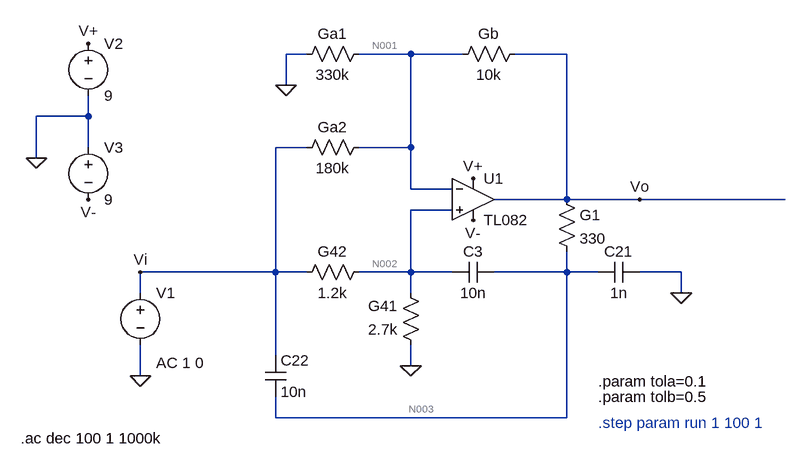
[diagram p0: schematic Sedra Etapa2.asc]
* Sedra Etapa2.asc
R§G42 N002 Vi 1.2k
R§G41 0 N002 2.7k
R§Ga2 Vi N001 180k
R§Ga1 0 N001 330k
R§Gb N001 Vo 10k
R§G1 Vo N003 330
* U1: TL082 (symbol PAULOlib\TL082 not available, pins judged from their places): In+=N002 In-=N001 V+=V+ V-=V- OUT=Vo
C3 N003 N002 10n
C22 Vi N003 10n
C21 0 N003 1n
V1 Vi 0 AC 1 0
V2 V+ 0 9
V3 0 V- 9
.param tola=0.1
.param tolb=0.5
* .step param run 1 100 1
.ac dec 100 1 1000k
.backanno
.end

* Results of the author's LTspice run, read from the files saved beside the schematic
* Operating Point, zero values left out:
*   V(n002) = -32.44 nV
*   V(n001) = 10.94 µV
*   V(vo) = 12.27 µV
*   V(n003) = 12.27 µV
*   V(v-) = -9 V
*   V(v+) = 9 V
*   I(Gb) = -133 pA
*   I(Ga1) = -33.15 pA
*   I(Ga2) = -60.77 pA
*   I(G41) = 12.02 pA
*   I(G42) = -27.04 pA
*   I(V3) = -8.595 mA
*   I(V2) = -8.594 mA
*   I(V1) = 33.73 pA
*   Ix(u1:1) = 39.05 pA
*   Ix(u1:2) = 39.05 pA
*   Ix(u1:3) = 8.594 mA
*   Ix(u1:4) = -8.595 mA
*   Ix(u1:5) = -133 pA
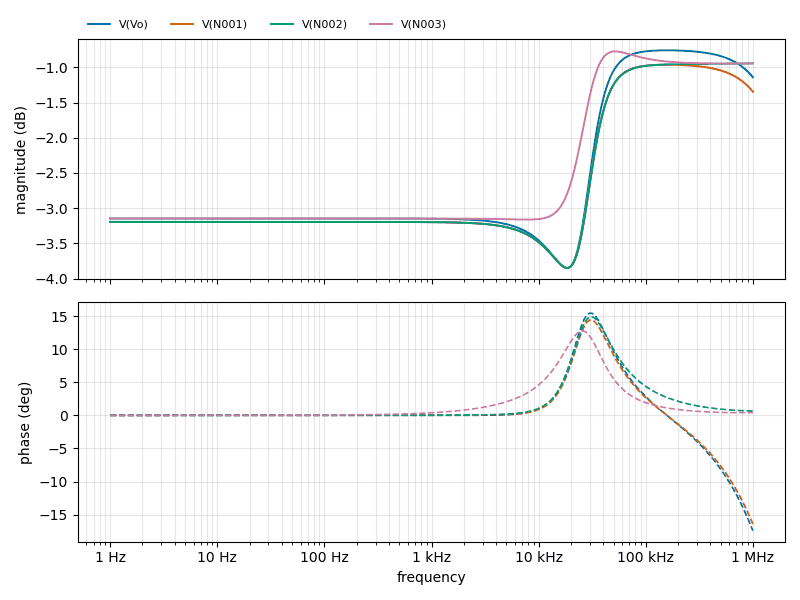
[diagram p1: AC Analysis of Sedra Etapa2.asc, plotted from the saved traces]
* AC Analysis, 1 run:
*   V(Vo): -3.15 dB at 1 Hz, -1.14 dB at 1 MHz, peak -0.76 dB at 158.5 kHz, 3 dB below the peak at 21.03 kHz
*   V(N001): -3.19 dB at 1 Hz, -1.35 dB at 1 MHz, peak -0.96 dB at 158.5 kHz
*   V(N002): -3.19 dB at 1 Hz, -0.94 dB at 1 MHz, peak -0.94 dB at 1 MHz
*   V(N003): -3.15 dB at 1 Hz, -0.94 dB at 1 MHz, peak -0.77 dB at 51.29 kHz